# Altium schematic sheet PCB-Schematic.SchDoc
size B; SheetNumber: 2; SheetTotal: 14
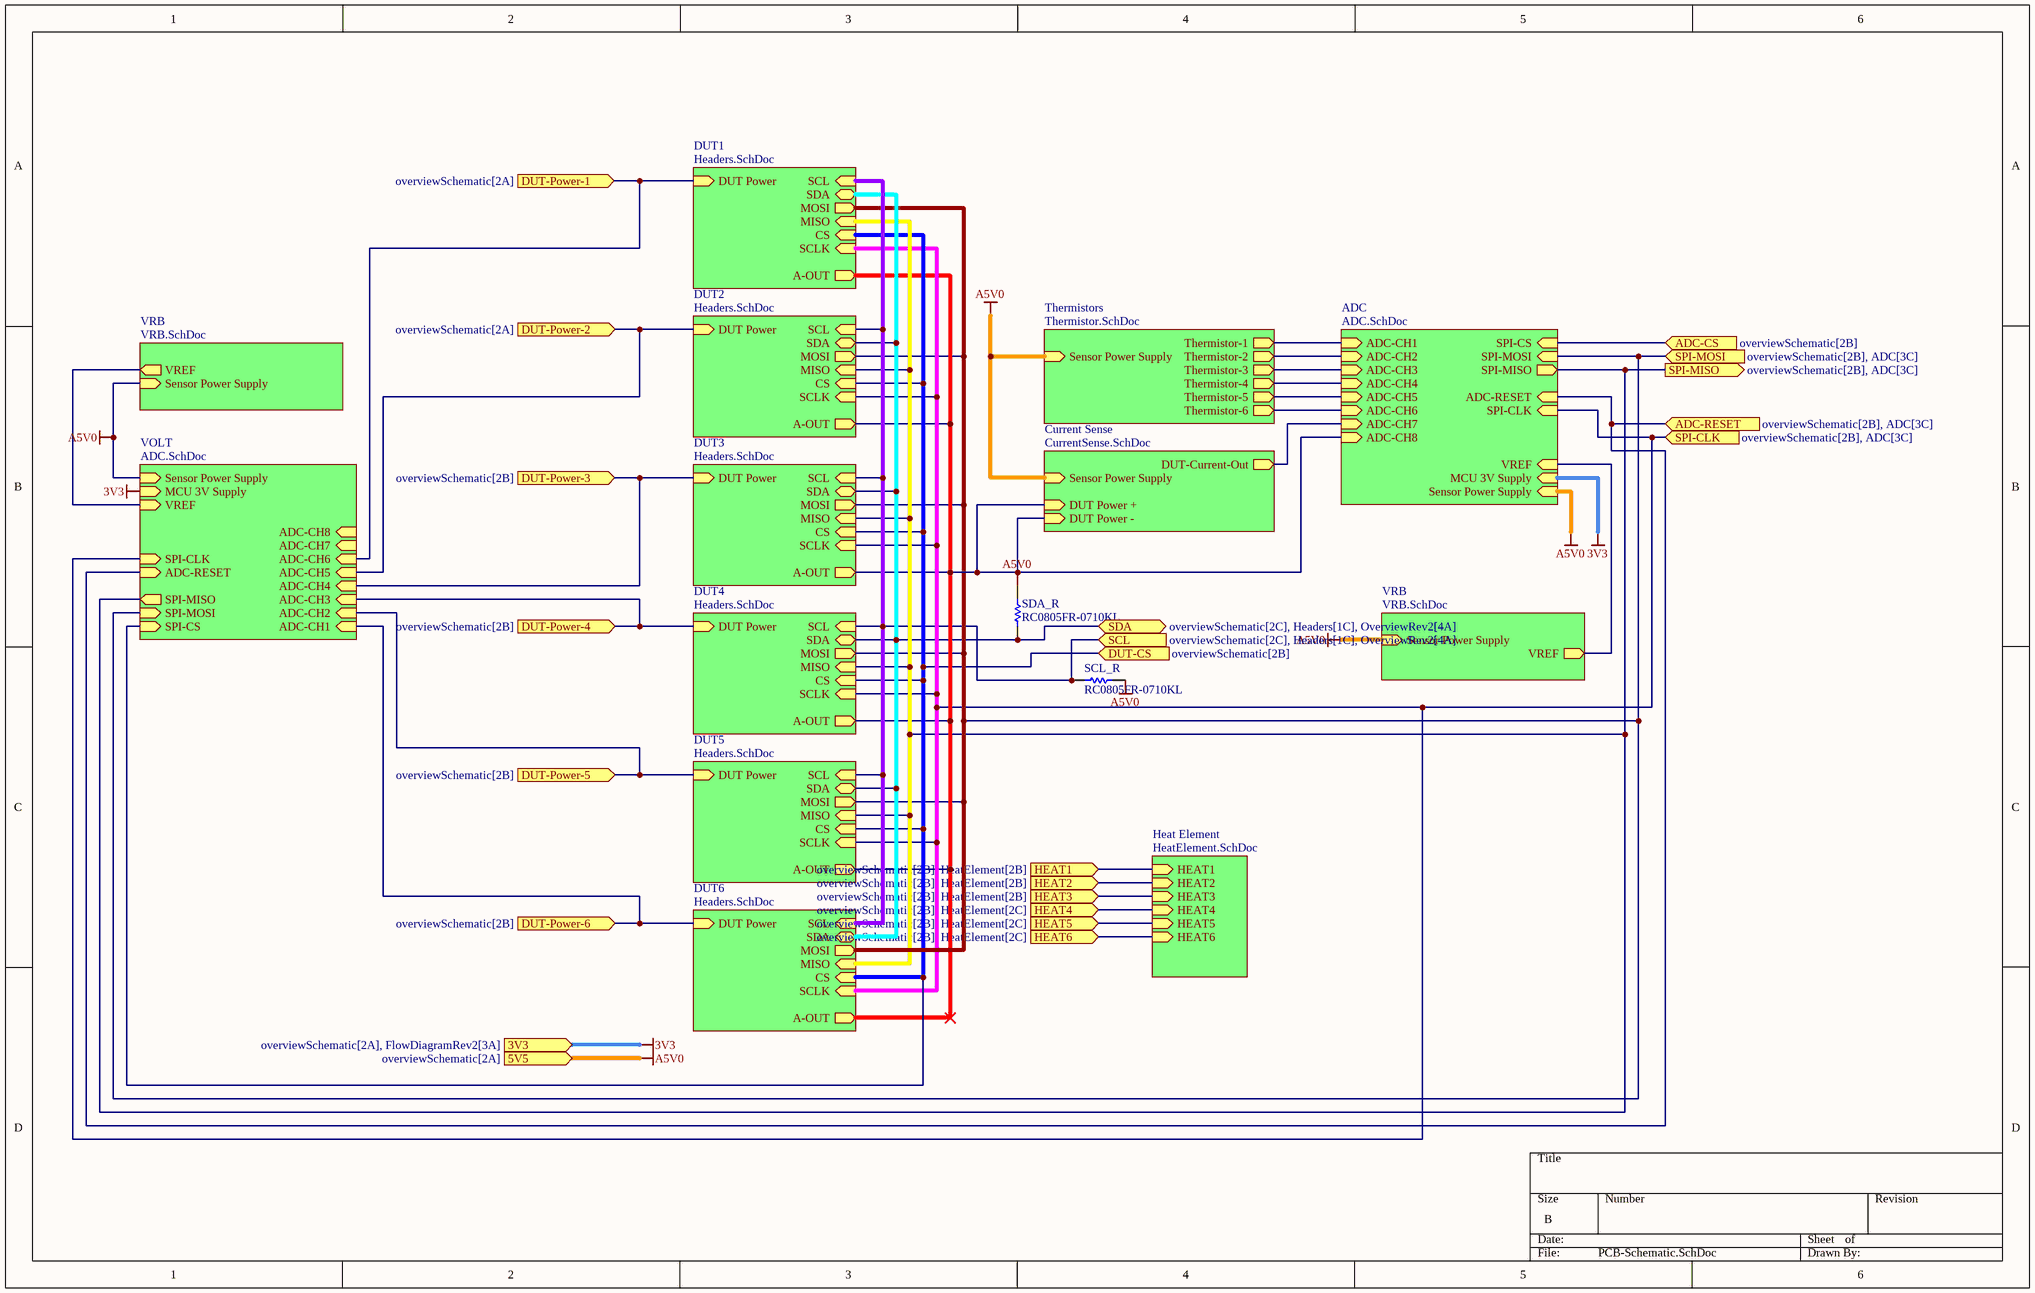
[diagram p0: PCB-Schematic.SchDoc]

## Parts
SCL_R  RC0805FR-0710KL  [RESC2013X60X35NL10T20]
SDA_R  RC0805FR-0710KL  [RESC2013X60X35NL10T20]

## Sub-sheets
ADC = ADC.SchDoc: ADC-CH1 (in), ADC-CH2 (in), ADC-CH3 (in), ADC-CH4 (in), ADC-CH5 (in), ADC-CH6 (in), SPI-CLK (in), SPI-MOSI (in), SPI-MISO (out), SPI-CS (in), ADC-RESET (in), ADC-CH7 (in), Sensor Power Supply (in), MCU 3V Supply (in), VREF (in), ADC-CH8 (in)
Current Sense = CurrentSense.SchDoc: DUT Power + (in), DUT Power - (in), DUT-Current-Out (out), Sensor Power Supply (in)
DUT1 = Headers.SchDoc: SCL (in), SDA (bidir), CS (in), SCLK (in), A-OUT (out), DUT Power (in), MOSI (out), MISO (in)
DUT2 = Headers.SchDoc: SCL (in), SDA (bidir), CS (in), SCLK (in), A-OUT (out), DUT Power (in), MOSI (out), MISO (in)
DUT3 = Headers.SchDoc: SCL (in), SDA (bidir), CS (in), SCLK (in), A-OUT (out), DUT Power (in), MOSI (out), MISO (in)
DUT4 = Headers.SchDoc: SCL (in), SDA (bidir), CS (in), SCLK (in), A-OUT (out), DUT Power (in), MOSI (out), MISO (in)
DUT5 = Headers.SchDoc: SCL (in), SDA (bidir), CS (in), SCLK (in), A-OUT (out), DUT Power (in), MOSI (out), MISO (in)
DUT6 = Headers.SchDoc: SCL (in), SDA (bidir), CS (in), SCLK (in), A-OUT (out), DUT Power (in), MOSI (out), MISO (in)
Heat Element = HeatElement.SchDoc: HEAT1 (in), HEAT2 (in), HEAT3 (in), HEAT4 (in), HEAT5 (in), HEAT6 (in)
Thermistors = Thermistor.SchDoc: Thermistor-6 (out), Thermistor-5 (out), Thermistor-1 (out), Thermistor-2 (out), Thermistor-3 (out), Thermistor-4 (out), Sensor Power Supply (in)
VOLT = ADC.SchDoc: ADC-CH1 (in), ADC-CH2 (in), ADC-CH3 (in), ADC-CH4 (in), ADC-CH5 (in), ADC-CH6 (in), SPI-CLK (in), SPI-MOSI (in), SPI-MISO (out), SPI-CS (in), ADC-RESET (in), ADC-CH7 (in), Sensor Power Supply (in), MCU 3V Supply (in), VREF (in), ADC-CH8 (in)
VRB = VRB.SchDoc: Sensor Power Supply (in), VREF (out)
VRB = VRB.SchDoc: Sensor Power Supply (in), VREF (out)

## Ports
3V3 (in, see overviewSchematic[2A], FlowDiagramRev2[3A]), 5V5 (in, see overviewSchematic[2A]), ADC-CS (in, see overviewSchematic[2B]), ADC-RESET (in, see overviewSchematic[2B], ADC[3C]), DUT-CS (in, see overviewSchematic[2B]), DUT-Power-1 (in, see overviewSchematic[2A]), DUT-Power-2 (in, see overviewSchematic[2A]), DUT-Power-3 (in, see overviewSchematic[2B]), DUT-Power-4 (in, see overviewSchematic[2B]), DUT-Power-5 (in, see overviewSchematic[2B]), DUT-Power-6 (in, see overviewSchematic[2B]), HEAT1 (in, see overviewSchematic[2B], HeatElement[2B]), HEAT2 (in, see overviewSchematic[2B], HeatElement[2B]), HEAT3 (in, see overviewSchematic[2B], HeatElement[2B]), HEAT4 (in, see overviewSchematic[2B], HeatElement[2C]), HEAT5 (in, see overviewSchematic[2B], HeatElement[2C]), HEAT6 (in, see overviewSchematic[2B], HeatElement[2C]), SCL (in, see overviewSchematic[2C], Headers[1C], OverviewRev2[4A]), SDA (bidir, see overviewSchematic[2C], Headers[1C], OverviewRev2[4A]), SPI-CLK (in, see overviewSchematic[2B], ADC[3C]), SPI-MISO (out, see overviewSchematic[2B], ADC[3C]), SPI-MOSI (in, see overviewSchematic[2B], ADC[3C])

## Nets
3V3: port 3V3, sheet ADC/MCU 3V Supply, sheet VOLT/MCU 3V Supply
A5V0: SCL_R.2 SDA_R.2 ; port 5V5, sheet ADC/Sensor Power Supply, sheet VRB/Sensor Power Supply, sheet Current Sense/Sensor Power Supply, sheet Thermistors/Sensor Power Supply, sheet VOLT/Sensor Power Supply, sheet VRB/Sensor Power Supply
ADC-CS: port ADC-CS, sheet ADC/SPI-CS
ADC-RESET: port ADC-RESET, sheet ADC/ADC-RESET, sheet VOLT/ADC-RESET
DUT-CS: port DUT-CS, sheet DUT1/CS, sheet DUT2/CS, sheet DUT3/CS, sheet DUT4/CS, sheet DUT5/CS, sheet DUT6/CS, sheet VOLT/SPI-CS
DUT-Power-1: port DUT-Power-1, sheet DUT1/DUT Power, sheet VOLT/ADC-CH6
DUT-Power-2: port DUT-Power-2, sheet DUT2/DUT Power, sheet VOLT/ADC-CH5
DUT-Power-3: port DUT-Power-3, sheet DUT3/DUT Power, sheet VOLT/ADC-CH4
DUT-Power-4: port DUT-Power-4, sheet DUT4/DUT Power, sheet VOLT/ADC-CH3
DUT-Power-5: port DUT-Power-5, sheet DUT5/DUT Power, sheet VOLT/ADC-CH2
DUT-Power-6: port DUT-Power-6, sheet DUT6/DUT Power, sheet VOLT/ADC-CH1
HEAT1: port HEAT1, sheet Heat Element/HEAT1
HEAT2: port HEAT2, sheet Heat Element/HEAT2
HEAT3: port HEAT3, sheet Heat Element/HEAT3
HEAT4: port HEAT4, sheet Heat Element/HEAT4
HEAT5: port HEAT5, sheet Heat Element/HEAT5
HEAT6: port HEAT6, sheet Heat Element/HEAT6
SCL: SCL_R.1 ; port SCL, sheet DUT1/SCL, sheet DUT2/SCL, sheet DUT3/SCL, sheet DUT4/SCL, sheet DUT5/SCL, sheet DUT6/SCL
SDA: SDA_R.1 ; port SDA, sheet DUT1/SDA, sheet DUT2/SDA, sheet DUT3/SDA, sheet DUT4/SDA, sheet DUT5/SDA, sheet DUT6/SDA
SPI-CLK: port SPI-CLK, sheet ADC/SPI-CLK, sheet DUT1/SCLK, sheet DUT2/SCLK, sheet DUT3/SCLK, sheet DUT4/SCLK, sheet DUT5/SCLK, sheet DUT6/SCLK, sheet VOLT/SPI-CLK
SPI-MISO: port SPI-MISO, sheet ADC/SPI-MISO, sheet DUT1/MISO, sheet DUT2/MISO, sheet DUT3/MISO, sheet DUT4/MISO, sheet DUT5/MISO, sheet DUT6/MISO, sheet VOLT/SPI-MISO
SPI-MOSI: port SPI-MOSI, sheet ADC/SPI-MOSI, sheet DUT1/MOSI, sheet DUT2/MOSI, sheet DUT3/MOSI, sheet DUT4/MOSI, sheet DUT5/MOSI, sheet DUT6/MOSI, sheet VOLT/SPI-MOSI
(unnamed): sheet ADC/ADC-CH1, sheet Thermistors/Thermistor-1
(unnamed): sheet ADC/ADC-CH2, sheet Thermistors/Thermistor-2
(unnamed): sheet ADC/ADC-CH3, sheet Thermistors/Thermistor-3
(unnamed): sheet ADC/ADC-CH4, sheet Thermistors/Thermistor-4
(unnamed): sheet ADC/ADC-CH5, sheet Thermistors/Thermistor-5
(unnamed): sheet ADC/ADC-CH6, sheet Thermistors/Thermistor-6
(unnamed): sheet ADC/ADC-CH7, sheet Current Sense/DUT-Current-Out
(unnamed): sheet ADC/VREF, sheet VRB/VREF
(unnamed): sheet ADC/ADC-CH8, sheet Current Sense/DUT Power +, sheet Current Sense/DUT Power -, sheet DUT1/A-OUT, sheet DUT2/A-OUT, sheet DUT3/A-OUT, sheet DUT4/A-OUT, sheet DUT5/A-OUT, sheet DUT6/A-OUT
(unnamed): sheet VOLT/VREF, sheet VRB/VREF

## Library data of the parts
SCL_R SDA_R = RESIST 0805: Chip Resistor, 10 KOhm, +/- 1%, 0.125 W, -55 to 155 degC, 0805 (2012 Metric), RoHS, Tape and Reel; Manufacturer: Yageo; Voltage Rating: 150 V; Mount: Surface Mount; ComponentLink1Description: Manufacturer URL; ComponentLink2URL: http://www.yageo.com/documents/recent/PYu-RC_Group_51_RoHS_L_04.pdf; Pins: 2; Length: 2 mm; Min Operating Temperature: -55 degC; Height: 0.5 mm; Mounting Technology: Surface Mount; RoHSCompliant: true; REACH SVHC: No SVHC; ComponentLink1URL: http://www.yageo.com/; Max Operating Temperature: 155 degC; PackageReference: 0805; DatasheetVersion: Rev. 4, 02/2016; Package Quantity: 5000; Packaging: Tape and Reel; ComponentLink2Description: Datasheet; PackageDescription: 2-Pin Surface Mounted Device, Body 2 x 1.25 mm